# Altium schematic sheet SH5 - SIGNAL CONDITIONING.SchDoc
size Letter; DrawnBy: Kyle Hong, Lance Bantoto
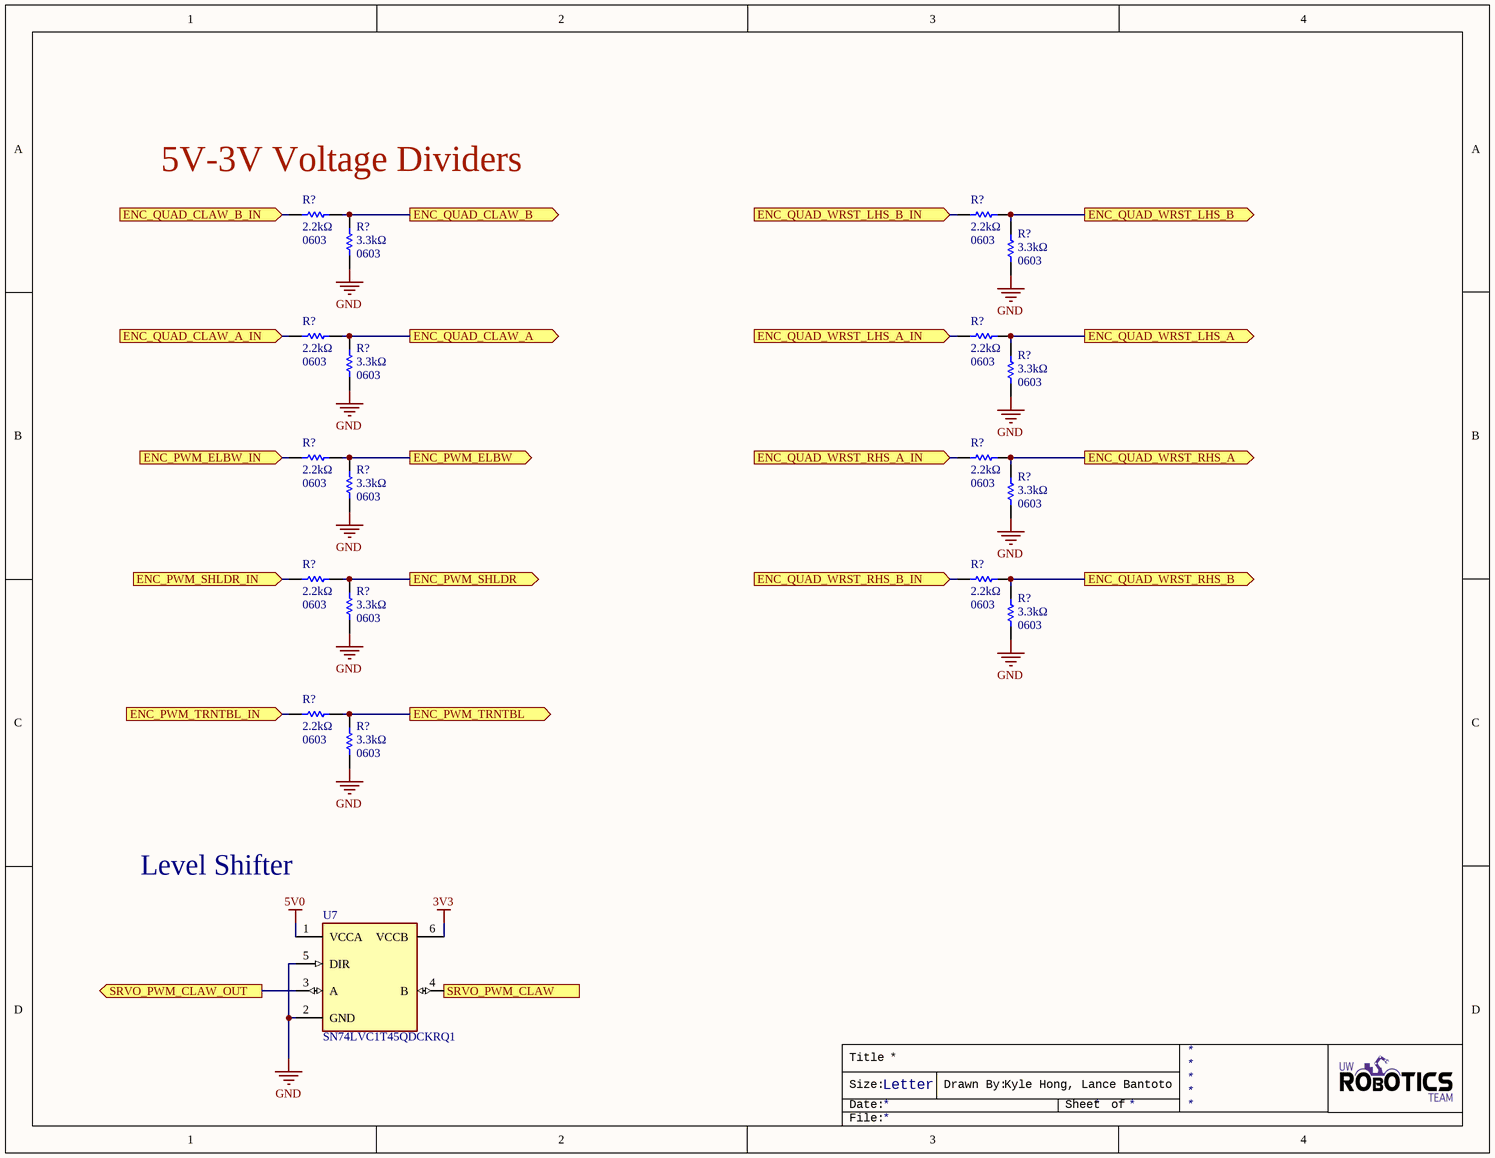
[diagram p0: SH5 - SIGNAL CONDITIONING.SchDoc]

## Parts
(Parts that share a designator on the sheet are numbered #1, #2 ... from top to bottom, then left to right.)
R?#1  value 2.2kΩ  Case Code (Imperial): 0603  [RESC0603(1608)_N]  (hidden comment: RES_2.2kΩ_0603)
R?#2  value 2.2kΩ  Case Code (Imperial): 0603  [RESC0603(1608)_N]  (hidden comment: RES_2.2kΩ_0603)
R?#3  value 3.3kΩ  Case Code (Imperial): 0603  [RESC0603(1608)_N]  (hidden comment: RES_3.3kΩ_0603)
R?#4  value 3.3kΩ  Case Code (Imperial): 0603  [RESC0603(1608)_N]  (hidden comment: RES_3.3kΩ_0603)
R?#5  value 2.2kΩ  Case Code (Imperial): 0603  [RESC0603(1608)_N]  (hidden comment: RES_2.2kΩ_0603)
R?#6  value 2.2kΩ  Case Code (Imperial): 0603  [RESC0603(1608)_N]  (hidden comment: RES_2.2kΩ_0603)
R?#7  value 3.3kΩ  Case Code (Imperial): 0603  [RESC0603(1608)_N]  (hidden comment: RES_3.3kΩ_0603)
R?#8  value 3.3kΩ  Case Code (Imperial): 0603  [RESC0603(1608)_N]  (hidden comment: RES_3.3kΩ_0603)
R?#9  value 2.2kΩ  Case Code (Imperial): 0603  [RESC0603(1608)_N]  (hidden comment: RES_2.2kΩ_0603)
R?#10  value 2.2kΩ  Case Code (Imperial): 0603  [RESC0603(1608)_N]  (hidden comment: RES_2.2kΩ_0603)
R?#11  value 3.3kΩ  Case Code (Imperial): 0603  [RESC0603(1608)_N]  (hidden comment: RES_3.3kΩ_0603)
R?#12  value 3.3kΩ  Case Code (Imperial): 0603  [RESC0603(1608)_N]  (hidden comment: RES_3.3kΩ_0603)
R?#13  value 2.2kΩ  Case Code (Imperial): 0603  [RESC0603(1608)_N]  (hidden comment: RES_2.2kΩ_0603)
R?#14  value 2.2kΩ  Case Code (Imperial): 0603  [RESC0603(1608)_N]  (hidden comment: RES_2.2kΩ_0603)
R?#15  value 3.3kΩ  Case Code (Imperial): 0603  [RESC0603(1608)_N]  (hidden comment: RES_3.3kΩ_0603)
R?#16  value 3.3kΩ  Case Code (Imperial): 0603  [RESC0603(1608)_N]  (hidden comment: RES_3.3kΩ_0603)
R?#17  value 2.2kΩ  Case Code (Imperial): 0603  [RESC0603(1608)_N]  (hidden comment: RES_2.2kΩ_0603)
R?#18  value 3.3kΩ  Case Code (Imperial): 0603  [RESC0603(1608)_N]  (hidden comment: RES_3.3kΩ_0603)
U7  SN74LVC1T45QDCKRQ1  [SOT65P210X110-6N]

## Ports
ENC_PWM_ELBW (out), ENC_PWM_ELBW_IN (in), ENC_PWM_SHLDR (out), ENC_PWM_SHLDR_IN (in), ENC_PWM_TRNTBL (out), ENC_PWM_TRNTBL_IN (in), ENC_QUAD_CLAW_A (out), ENC_QUAD_CLAW_A_IN (in), ENC_QUAD_CLAW_B (out), ENC_QUAD_CLAW_B_IN (in), ENC_QUAD_WRST_LHS_A (out), ENC_QUAD_WRST_LHS_A_IN (in), ENC_QUAD_WRST_LHS_B (out), ENC_QUAD_WRST_LHS_B_IN (in), ENC_QUAD_WRST_RHS_A (out), ENC_QUAD_WRST_RHS_A_IN (in), ENC_QUAD_WRST_RHS_B (out), ENC_QUAD_WRST_RHS_B_IN (in), SRVO_PWM_CLAW (in), SRVO_PWM_CLAW_OUT (out)

## Nets
3V3: U7.6(VCCB)
5V0: U7.1(VCCA)
GND: R?#3.1 R?#4.1 R?#7.1 R?#8.1 R?#11.1 R?#12.1 R?#15.1 R?#16.1 R?#18.1 U7.2(GND) U7.5(DIR)
ENC_PWM_ELBW: R?#9.2 R?#11.2 ; port ENC_PWM_ELBW
ENC_PWM_ELBW_IN: R?#9.1 ; port ENC_PWM_ELBW_IN
ENC_PWM_SHLDR: R?#13.2 R?#15.2 ; port ENC_PWM_SHLDR
ENC_PWM_SHLDR_IN: R?#13.1 ; port ENC_PWM_SHLDR_IN
ENC_PWM_TRNTBL: R?#17.2 R?#18.2 ; port ENC_PWM_TRNTBL
ENC_PWM_TRNTBL_IN: R?#17.1 ; port ENC_PWM_TRNTBL_IN
ENC_QUAD_CLAW_A: R?#5.2 R?#7.2 ; port ENC_QUAD_CLAW_A
ENC_QUAD_CLAW_A_IN: R?#5.1 ; port ENC_QUAD_CLAW_A_IN
ENC_QUAD_CLAW_B: R?#1.2 R?#3.2 ; port ENC_QUAD_CLAW_B
ENC_QUAD_CLAW_B_IN: R?#1.1 ; port ENC_QUAD_CLAW_B_IN
ENC_QUAD_WRST_LHS_A: R?#6.2 R?#8.2 ; port ENC_QUAD_WRST_LHS_A
ENC_QUAD_WRST_LHS_A_IN: R?#6.1 ; port ENC_QUAD_WRST_LHS_A_IN
ENC_QUAD_WRST_LHS_B: R?#2.2 R?#4.2 ; port ENC_QUAD_WRST_LHS_B
ENC_QUAD_WRST_LHS_B_IN: R?#2.1 ; port ENC_QUAD_WRST_LHS_B_IN
ENC_QUAD_WRST_RHS_A: R?#10.2 R?#12.2 ; port ENC_QUAD_WRST_RHS_A
ENC_QUAD_WRST_RHS_A_IN: R?#10.1 ; port ENC_QUAD_WRST_RHS_A_IN
ENC_QUAD_WRST_RHS_B: R?#14.2 R?#16.2 ; port ENC_QUAD_WRST_RHS_B
ENC_QUAD_WRST_RHS_B_IN: R?#14.1 ; port ENC_QUAD_WRST_RHS_B_IN
SRVO_PWM_CLAW: U7.4(B) ; port SRVO_PWM_CLAW
SRVO_PWM_CLAW_OUT: U7.3(A) ; port SRVO_PWM_CLAW_OUT

## Notes on the sheet
- (near R?#1) 5V-3V Voltage Dividers
- Level Shifter
- Title
- Size:
- Date:
- Letter
- Drawn By:
- Sheet
- of
- File:

## Library data of the parts
R?#1 R?#2 R?#5 R?#6 R?#9 R?#10 R?#13 R?#14 R?#17 = RES_2.2kΩ_0603: RES SMD 2.2K OHM 1% 1/10W 0603; Manufacturer 1: Yageo; Manufacturer Part Number 1: RC0603FR-072K2L; Dimensions: 0.063" L x 0.031" W (1.60mm x 0.80mm); Package: 0603 (1608 Metric); Supplier Part Number 1: 311-2.20KHRCT-ND; Supplier 1: Digi-Key; Mount: Surface Mount; Case Code (Metric): 1608; Tolerance: 1%
R?#3 R?#4 R?#7 R?#8 R?#11 R?#12 R?#15 R?#16 R?#18 = RES_3.3kΩ_0603: RES SMD 3.3K OHM 5% 1/10W 0603; Manufacturer 1: Yageo; Manufacturer Part Number 1: RC0603JR-073K3L; Dimensions: 0.063" L x 0.031" W (1.60mm x 0.80mm); Package: 0603 (1608 Metric); Supplier 1: Digi-Key; Supplier Part Number 1: 311-3.3KGRCT-ND; Mount: Surface Mount; Case Code (Metric): 1608; Tolerance: 5%
U7 = IC_LVL_SHIFTER_TI: IC BIDIRECTIONAL LEVEL SHIFTER; Manufacturer 1: Texas Instruments; Data Rate: 420Mbps; Number of Channels: 1; Logic Function: Translator; Turn-On Delay Time: 6.9ns; High Level Output Current: -32mA; Low Level Output Current: 32mA; Quiescent Current: 10uA; Max Supply Voltage: 5.5V; Min Supply Voltage: 1.65V; Supplier 1: Digi-Key; Manufacturer Part Number 1: SN74LVC1T45QDCKRQ1; Stock 1: 7633; Pricing 1: 1=0.59000, 10=0.51500, 25=0.48360, 100=0.39470, 250=0.36660, 500=0.31200, 1000=0.24960 (USD); RoHS: Yes; Mount: Surface Mount; Case/Package: SC; Number of Pins: 6; Weight: 0.000988oz; Min Operating Temperature: -40°C; Max Operating Temperature: 125°C; Number of Bits: 1; Channel Type: Bidirectional; Number of Circuits: 1; Packaging: Tape and Reel; Propagation Delay: 6.9ns; Package Quantity: 3000; Radiation Hardening: No; Lead Free: Lead Free; REACH SVHC: No SVHC; ComponentLink1URL: https://datasheet.ciiva.com/6615/sn74lvc1t45-q1-6615008.pdf?src-supplier=Digi-Key; ComponentLink1Description: https://datasheet.ciiva.com/6615/sn74lvc1t45-q1-6615008.pdf?src-supplier=Digi-Key; ComponentLink2URL: https://datasheet.ciiva.com/12072/sces677b-213901-12072996.pdf?src-supplier=Mouser; ComponentLink2Description: https://datasheet.ciiva.com/12072/sces677b-213901-12072996.pdf?src-supplier=Mouser; ComponentLink3URL: https://datasheet.ciiva.com/15096/getdatasheetpartid-701994-15096516.pdf?src-supplier=Verical; ComponentLink3Description: https://datasheet.ciiva.com/15096/getdatasheetpartid-701994-15096516.pdf?src-supplier=Verical; ComponentLink4URL: https://datasheet.ciiva.com/29887/sn74lvc1t45-q1-29887614.pdf?src-supplier=Avnet; ComponentLink4Description: https://datasheet.ciiva.com/29887/sn74lvc1t45-q1-29887614.pdf?src-supplier=Avnet; Supplier Part Number 1: 296-39212-1-ND